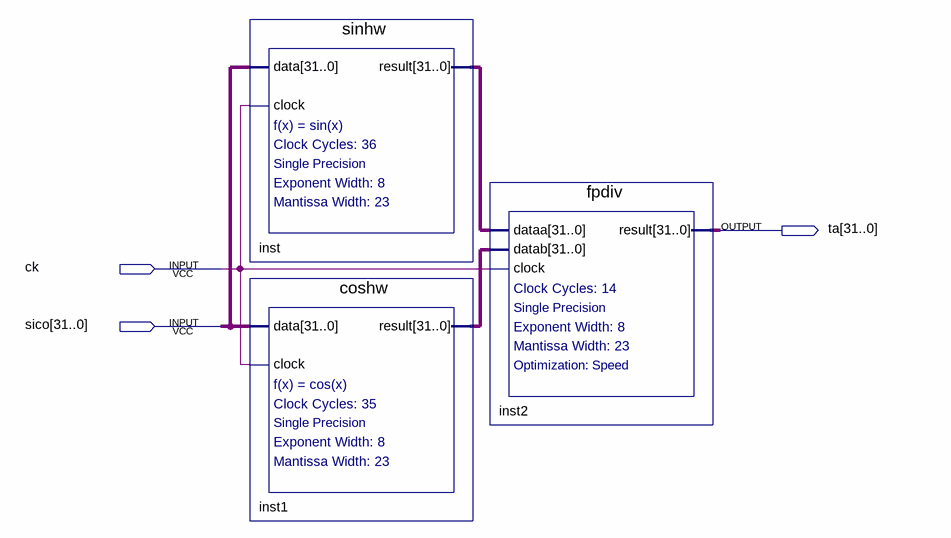
[diagram p0: schematic sheet]
// Quartus schematic tanhw.bdf as structural Verilog: 3 symbols, 3 pins
module tanhw (
  input  ck,
  input  [31:0] sico,
  output [31:0] ta
);

  wire [31:0] inst1_result, inst_result;

  sinhw inst (.data(sico), .clock(ck), .result(inst_result));
  coshw inst1 (.data(sico), .clock(ck), .result(inst1_result));
  fpdiv inst2 (.dataa(inst_result), .datab(inst1_result), .clock(ck), .result(ta));
endmodule
